# Altium schematic sheet Esquematico.SchDoc
size A4; SheetNumber: 1; SheetTotal: 1
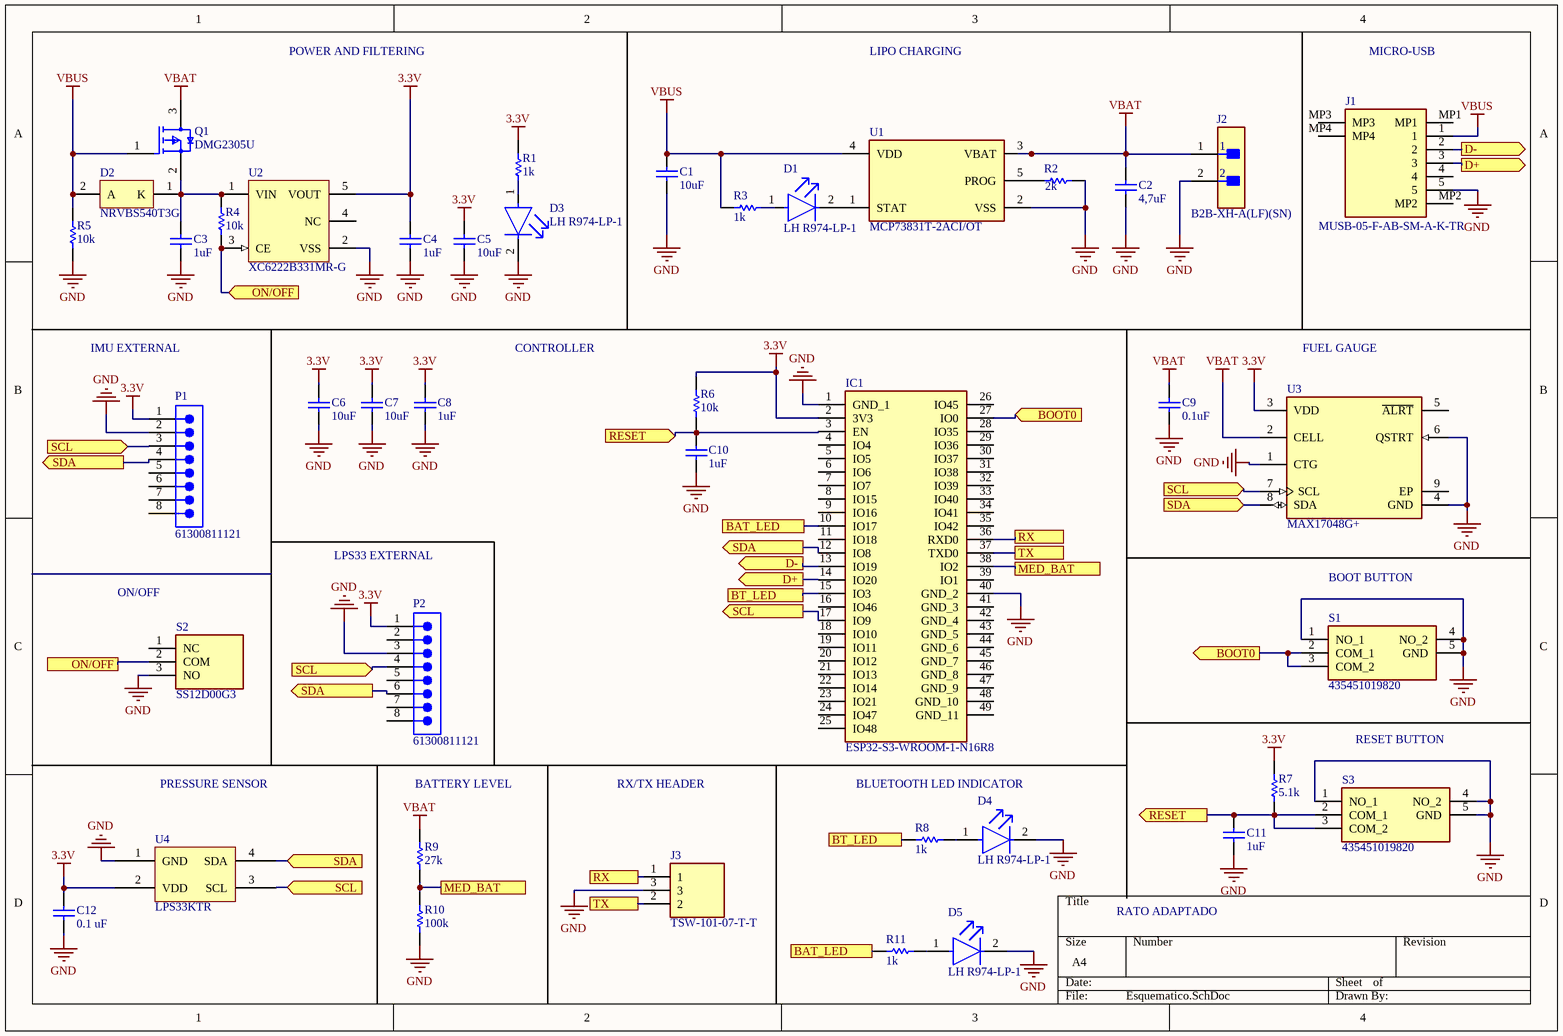
[diagram p0: Esquematico.SchDoc]

## Parts
C1  10uF  [CAPC2013X88X50LL20T25]
C2  4,7uF  [CAPC2013X88X50LL20T25]
C3  1uF  [CAPC2013X88X50LL20T25]
C4  1uF  [CAPC2013X88X50LL20T25]
C5  10uF  [CAPC2013X88X50LL20T25]
C6  10uF  [CAPC2013X88X50LL20T25]
C7  10uF  [CAPC2013X88X50LL20T25]
C8  1uF  [CAPC2013X88X50LL20T25]
C9  0.1uF  [CAPC2013X88X50LL20T25]
C10  1uF  [CAPC2013X88X50LL20T25]
C11  1uF  [CAPC2013X88X50LL20T25]
C12  0.1 uF  [CAPC2013X88X50LL20T25]
D1  LH R974-LP-1  [FP-LH_R974-MFG]
D2  NRVBS540T3G  [ONSC-SMC-2-403-03_V]
D3  LH R974-LP-1  [FP-LH_R974-MFG]
D4  LH R974-LP-1  [FP-LH_R974-MFG]
D5  LH R974-LP-1  [FP-LH_R974-MFG]
IC1  ESP32-S3-WROOM-1-N16R8  [ESP32S3WROOM1N16R8]
J1  MUSB-05-F-AB-SM-A-K-TR  [MUSB05FABSMAKTR]
J2  B2B-XH-A(LF)(SN)  [FP-B2B-XH-A_LF_SN-MFG]
J3  TSW-101-07-T-T  [HDRV3W64P254_3X1_254X762X838P]
P1  61300811121  [61300811121]
P2  61300811121  [61300811121]
Q1  DMG2305U  [FP-SOT23-MFG]
R1  1k  [RESC2013X50X30LL20T20]
R2  2k  [RESC2013X50X30LL20T20]
R3  1k  [RESC2013X50X30LL20T20]
R4  10k  [RESC2013X50X30LL20T20]
R5  10k  [RESC2013X50X30LL20T20]
R6  10k  [RESC2013X50X30LL20T20]
R7  5.1k  [RESC2013X50X30LL20T20]
R8  1k  [RESC2013X50X30LL20T20]
R9  27k  [RESC2013X50X30LL20T20]
R10  100k  [RESC2013X50X30LL20T20]
R11  1k  [RESC2013X50X30LL20T20]
S1  435451019820  [435451019820]
S2  SS12D00G3  [SS12D00G3]
S3  435451019820  [435451019820]
U1  MCP73831T-2ACI/OT  [FP-C04-091-OT-IPC_B]
U2  XC6222B331MR-G  [TORX-SOT-25-5_L]
U3  MAX17048G+  [FP-T822-3-MFG]
U4  LPS33KTR  [LPS33KTR]

## Ports
BAT_LED, BOOT0 (in), BOOT0 (out), BT_LED, D+ (out), D- (out), MED_BAT, ON/OFF, ON/OFF (in), RESET (in), RESET (out), RX, SCL (in), SCL (out), SDA (in), SDA (out), TX

## Nets
3.3V: C4.2 C5.2 C6.2 C7.2 C8.2 C12.1 IC1.2(3V3) P1.1 P2.1 R1.2 R6.2 R7.1 U2.5(VOUT) U3.3(VDD) U4.2(VDD)
GND: C1.1 C2.1 C3.1 C4.1 C5.1 C6.1 C7.1 C8.1 C9.1 C10.1 C11.1 C12.2 D3.2(C) D4.2(C) D5.2(C) IC1.1(GND_1) IC1.40(GND_2) J1.5 J2.2 J3.3 P1.2 P2.3 R2.1 R5.1 R10.1 S1.1(NO_1) S1.4(NO_2) S1.5(GND) S2.3(NO) S3.1(NO_1) S3.4(NO_2) S3.5(GND) U1.2(VSS) U2.2(VSS) U3.1(CTG) U3.4(GND) U3.6(QSTRT) U4.1(GND)
VBAT: C2.2 C9.2 J2.1 Q1.3(D) R9.2 U1.3(VBAT) U3.2(CELL)
VBUS: C1.2 D2.2(A) J1.1 Q1.1(G) R3.2 R5.2 U1.4(VDD)
BAT_LED: IC1.10(IO17) R11.2 ; port BAT_LED
BOOT0: IC1.27(IO0) S1.2(COM_1) S1.3(COM_2) ; port BOOT0
BT_LED: IC1.15(IO3) R8.2 ; port BT_LED
D+: IC1.14(IO20) J1.3 ; port D+
D-: IC1.13(IO19) J1.2 ; port D-
MED_BAT: IC1.38(IO2) R9.1 R10.2 ; port MED_BAT
ON/OFF: R4.1 S2.2(COM) U2.3(CE) ; port ON/OFF
RESET: C10.2 C11.2 IC1.3(EN) R6.1 R7.2 S3.2(COM_1) S3.3(COM_2) ; port RESET
RX: IC1.36(RXD0) J3.1 ; port RX
SCL: IC1.17(IO9) P1.3 P2.4 U3.7(SCL) U4.3(SCL) ; port SCL
SDA: IC1.12(IO8) P1.4 P2.6 U3.8(SDA) U4.4(SDA) ; port SDA
TX: IC1.37(TXD0) J3.2 ; port TX
NetC3_2: C3.2 D2.1(K) Q1.2(S) R4.2 U2.1(VIN)
NetD1_1: D1.1(A) R3.1
NetD1_2: D1.2(C) U1.1(STAT)
NetD3_1: D3.1(A) R1.1
NetD4_1: D4.1(A) R8.1
NetD5_1: D5.1(A) R11.1
NetR2_2: R2.2 U1.5(PROG)

Not connected (* = marked no-connect by the designer): IC1 4(IO4) 5(IO5) 6(IO6) 7(IO7) 8(IO15) 9(IO16) 11(IO18) 16(IO46) 18(IO10) 19(IO11) 20(IO12) 21(IO13) 22(IO14) 23(IO21) 24(IO47) 25(IO48) 26(IO45) 28(IO35) 29(IO36) 30(IO37) 31(IO38) 32(IO39) 33(IO40) 34(IO41) 35(IO42) 39(IO1) 41(GND_3) 42(GND_4) 43(GND_5) 44(GND_6) 45(GND_7) 46(GND_8) 47(GND_9) 48(GND_10) 49(GND_11); J1 4 MP1 MP2 MP3 MP4; P1 5 6 7 8; P2 2 5 7 8; S2 1(NC); U2 4(NC); U3 5(~{ALRT}) 9(EP)

## Notes on the sheet
- POWER AND FILTERING
- LIPO CHARGING
- MICRO-USB
- IMU EXTERNAL
- CONTROLLER
- FUEL GAUGE
- LPS33 EXTERNAL
- BOOT BUTTON
- ON/OFF
- PRESSURE SENSOR
- BATTERY LEVEL
- RX/TX HEADER
- BLUETOOTH LED INDICATOR
- RESET BUTTON
- RATO ADAPTADO

## Library data of the parts
C1-C12 = CMP-2007-00266-1: Manufacturer: Kemet; Part Number: C0805C103K5RACTU
D1 D3-D5 = CMP-2000-06540-2: LED RED DIFFUSED 0805 SMD; Number of Elements: 1; Forward Voltage: 2.6V; Viewing Angle: 160°; Reverse Voltage: 5V; Test Current: 20mA; Dominant Wavelength: 645nm; Forward Current: 30mA; Luminous Intensity: 15mcd; Depth: 1.35mm; Min Operating Temperature: -30°C; Length: 2.1mm; Max Operating Temperature: 85°C; Radiation Hardening: No; Packaging: Tape and Reel; Number of Pins: 2; Mount: Surface Mount; Lens Style: Diffused
D2 = CMP-1055-00391-1: Schottky Power Rectifier, 2-Pin SMC, Pb-Free, Tape and Reel; Manufacturer: On Semiconductor; IFSM Max (A): 190; Configuration: Single; PartNumber: NRVBS540T3G; ComponentLink2Description: Datasheet; Packing: Tape and Reel; PackageReference: SMC-2-403-03; DatasheetVersion: Rev. 8; ComponentLink1Description: Manufacturer URL; ComponentLink2URL: http://www.onsemi.cn/pub_link/Collateral/MBRS540T3-D.PDF; ComponentLink3URL: http://www.onsemi.com/pub_link/Collateral/403-03.PDF; ComponentLink1URL: http://www.onsemi.com/; ComponentLink3Description: Package Specification; PackageDescription: 2-Pin Small Molded Package, J-Bend Lead, Body 5.845 x 6.855 mm; RoHS: TRUE; Mounting Technology: Surface Mount; PackageVersion: Rev. E, 08/2005
IC1 = ESP32-S3-WROOM-1-N16R8: Integrated Circuit; Manufacturer_Name: Espressif Systems; Datasheet Link: https://www.espressif.com/sites/default/files/documentation/esp32-s3-wroom-1_wroom-1u_datasheet_en.pdf; Height: 3.25mm; Manufacturer_Part_Number: ESP32-S3-WROOM-1-N16R8; Mouser Part Number: 356-ESP32S3WRM1N16R8; Mouser Price/Stock: https://www.mouser.co.uk/ProductDetail/Espressif-Systems/ESP32-S3-WROOM-1-N16R8?qs=Li%252BoUPsLEnvQc9gW6AMhZg%3D%3D
J1 = MUSB-05-F-AB-SM-A-K-TR: Connector; Manufacturer_Name: SAMTEC; Datasheet Link: http://suddendocs.samtec.com/prints/musb-05-x-ab-sm-a-xx-mkt.pdf; Height: 4.1mm; Manufacturer_Part_Number: MUSB-05-F-AB-SM-A-K-TR; Mouser Part Number: 200-MUSB05FABSMAKTR; Mouser Price/Stock: https://www.mouser.co.uk/ProductDetail/Samtec/MUSB-05-F-AB-SM-A-K-TR?qs=FESYatJ8odIUaVE%2F1ECHaA%3D%3D; Arrow Part Number: MUSB-05-F-AB-SM-A-K-TR; Arrow Price/Stock: https://www.arrow.com/en/products/musb-05-f-ab-sm-a-k-tr/samtec?region=nac
J2 = CMP-2000-05888-3: CONN HEADER VERT 2POS 2.5MM; Current Rating: 3A; Voltage Rating: 250V; Number of Contacts: 2; Contact Resistance: 20mR; Wire/Cable Gauge: 22AWG; Insulation Resistance: 1GR; Connector Type: Male Pin; Packaging: Bulk; Contact Material: Brass; Lead Free: Lead Free; Orientation: Straight; Contact Plating: Tin; Max Current Rating: 3A; Termination: Solder; Fastening Type: Detent; Depth: 5.75mm; Housing Material: Polyamide; REACH SVHC: No SVHC; Series: XH; Voltage Rating (AC): 250V; Number of Positions: 2; Color: Natural; Contact Type: Male Pin; Max Voltage Rating (DC): 250V; Pitch: 2.5mm; Lead Pitch: 2.5mm; Mount: Through Hole; Max Operating Temperature: 85°C; Length: 7.4mm; Max Voltage Rating (AC): 250V; Min Operating Temperature: -25°C; Number of Rows: 1; Housing Color: White
J3 = TSW-101-07-T-T: Connector; Manufacturer_Name: SAMTEC; Datasheet Link: https://suddendocs.samtec.com/catalog_english/tsw_th.pdf; Height: 8.38mm; Manufacturer_Part_Number: TSW-101-07-T-T
P1 P2 = CMP-1502-01076-3: NexarPartId: 32855533; Connector Type: Male Pin; Number of Contacts: 8; Voltage Rating: 250V; Current Rating: 3A; Contact Resistance: 20mΩ; Pitch: 2.54mm; Gender: Male; Termination: Solder; Contact Material: Copper; Mount: Through Hole; Lead Pitch: 2.54mm; Number of Positions: 8; Operating Supply Voltage: 250V; Number of Pins: 8; Max Operating Temperature: 105°C; Height: 8.54mm; REACH SVHC: Unknown; Number of Rows: 1; Packaging: Bulk; Contact Plating: Gold; Contact Mating Length: 5.9944mm; Orientation: Vertical; RoHS: Compliant; Color: Black; Min Operating Temperature: -40°C
Q1 = CMP-12801-000021-1: MOSFET P-CH 20V 4.2A SOT23; Manufacturer: Diodes Inc.; Manufacturer Part Number: DMG2305UX-13; Input Capacitace At Vds: 808pF @ -15V; Rthja Max: 90°C/W; Drain To Source Voltage: -20V; Standoff Height: 0.013mm; Number Of P Channels: 1; Gate To Source Voltage: 8V; Turn On Delay Time: 10.8ns; Pulse Drain Current: -15A; Threshold Vgs Max: -0.9V; Max Junction Temp: +150°C; Depletion Mode: False; Drain To Source Resistance: 40mΩ; Threshold Vgs Min: -0.5V; Continuous Drain Current: -4.2A; Turn Off Delay Time: 79.3ns; Gate Charge At Vgs: 10.2nC @ -4.5V; Power Dissipation: 1.4W; Digikey Description: MOSFET P-CH 20V 4.2A SOT23; Temperature Range High: +150°C; Height: 1.1mm; Package: SOT23; Footprint Url: https://www.diodes.com/assets/Package-Files/SOT23.pdf; Device Class L3: MOSFETs; RoHS: TRUE; Temperature: -55°C to +150°C; Mouser Description: MOSFET P-Ch ENH FET -20V 52mOhm -5.0V; Temperature Range Low: -55°C; ComponentLink2Description: Datasheet; Octopart: https://octopart.com/dmg2305ux-13-diodes+inc.-29925594; Ipc Land Pattern Name: SOT92P240X102-3; Device Class L2: Transistors; Automotive: No; Number Of Channels: 1; Drain To Source Breakdown Voltage: -20V; Lead Free: Yes; Device Class L1: Discrete Semiconductors; Category: Trans; ComponentLink2URL: https://www.diodes.com/assets/Datasheets/DMG2305UX.pdf
R1-R11 = CMP-2001-04896-1: Manufacturer: Vishay Dale; Part Number: CRCW08050000Z0EA
S1 S3 = 435451019820: Switch; Manufacturer_Name: Wurth Elektronik; Datasheet Link: https://www.we-online.com/components/products/datasheet/435451019820.pdf; Height: 1.97mm; Manufacturer_Part_Number: 435451019820; Mouser Part Number: 710-435451019820; Mouser Price/Stock: https://www.mouser.co.uk/ProductDetail/Wurth-Elektronik/435451019820?qs=ufv2HEpFn%252BSBtTHyYvulMg%3D%3D
S2 = SS12D00G3: Switch; Manufacturer_Name: Vimex; Datasheet Link: http://vimex.com/switches/techdocs/SS12D00-tech.pdf; Height: 7mm; Manufacturer_Part_Number: SS12D00G3
U1 = CMP-0133-00143-2: IC CONTROLLR LI-ION 4.2V SOT23-5; Max Power Dissipation: 1.54W; Output Current: 500mA; Max Output Voltage: 4.5V; Number of Outputs: 1; Min Output Voltage: 4.168V; Min Supply Voltage: 3.75V; Max Input Voltage: 6V; Voltage Rating: 4.534V; Drain to Source Resistance: 350mR; Max Operating Temperature: 85°C; Length: 0.122inch; Number of Pins: 5; REACH SVHC: No SVHC; Radiation Hardening: No; Min Operating Temperature: -40°C; Weight: 0.00709oz; Contact Plating: Tin; Termination: SMD/SMT; Case/Package: SOT-23; Mount: Surface Mount; Width: 0.071inch; Packaging: Tape and Reel; Number of Cells: 1; Max Charge Current: 500mA; Height: 0.051inch; Number of Channels: 1; Output Voltage: 4.2V; Max Supply Voltage: 6V; Lead Free: Lead Free
U2 = CMP-0659-00001-1: High Speed LDO Regulator, 700 mA, 1.7 to 6.0 V, -40 to 85 degC, SOT-25 (MR-G), RoHS, Tape and Reel; Manufacturer: Torex; Low Power Consumption: 100 uA; Output Voltage: 0.8 to 5 V (0.05 V increments); Accuracy: +/- 1% (Vout>2.0 V) +/- 0.02 V (Vout<=2.0 V); Dropout Voltage: 120 mV @Iout=300 mA (Vout=3.0 V); Out Current (Max): 700 mA; Operating Voltage Range: 1.7 to 6 V; ComponentLink2Description: Datasheet; ComponentLink1Description: Manufacturer URL; PackageDescription: 5-Pin Small Out-Line Transistor, Body 2.9 x 1.6 mm, Pitch 0.95 mm; Mounting Technology: Surface Mount; DatasheetVersion: Dec-13; ComponentLink1URL: http://www.torex.co.jp/; Operating Ambient Temperature: -40 to 85 degC; PartNumber: XC6222B331MR-G; ComponentLink2URL: http://www.torex.co.jp/english/products/voltage_regulators/data/XC6222.pdf; Packing: Tape and Reel; PackageReference: MR-G-5; RoHS: TRUE
U3 = CMP-05715-000164-1: IC BATT MON LI-ION 1CELL 8TDFN; Operating Supply Voltage: 4.5V; Operating Supply Current: 23uA; Output Voltage: 400mV; Max Operating Temperature: 85°C; Number of Pins: 8; Radiation Hardening: No; Min Operating Temperature: -20°C; Packaging: Rail/Tube; Mount: Surface Mount; RoHS Compliant: Yes; Package Quantity: 1; Series: ModelGauge™